# EAGLE schematic mote (EAGLE 8.4.0)
AUTHOR: NEAL JACKSON; REV: A; TITLE: MOTE

## Sheet 1 of 5
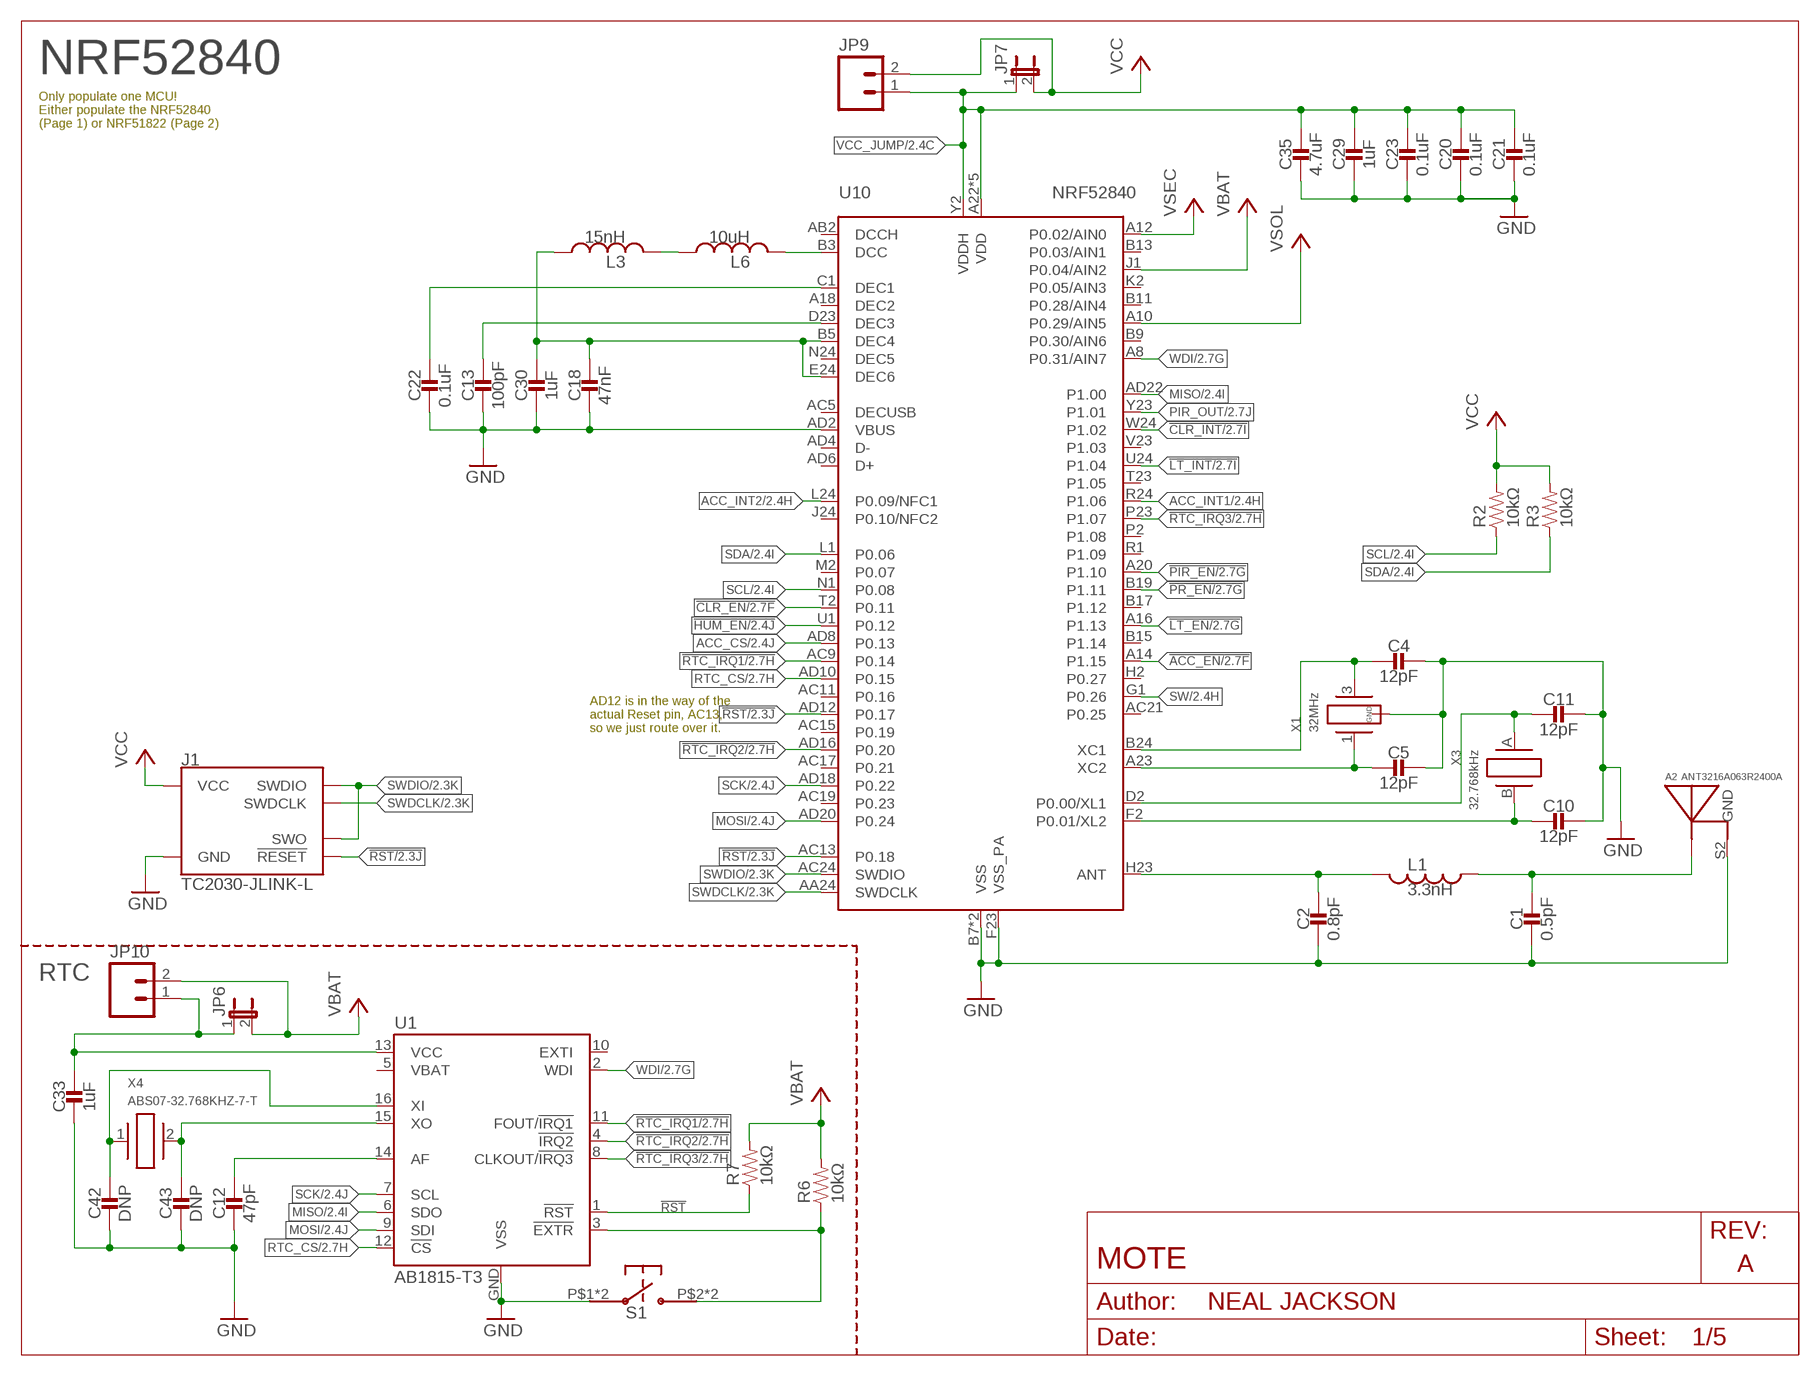
[diagram p0: schematic, sheet 1]

### Parts
A2  ANT3216A063R2400A  [ANT3216A063R2400A]
C1  0.5pF  CAPACITOR0402_CAP  [0402_CAP]
C2  0.8pF  CAPACITOR0402_CAP  [0402_CAP]
C4  12pF  CAPACITOR0402_CAP  [0402_CAP]
C5  12pF  CAPACITOR0402_CAP  [0402_CAP]
C10  12pF  CAPACITOR0402_CAP  [0402_CAP]
C11  12pF  CAPACITOR0402_CAP  [0402_CAP]
C12  47pF  CAPACITOR0402_CAP  [0402_CAP]
C13  100pF  CAPACITOR0402_CAP  [0402_CAP]
C18  47nF  CAPACITOR0402_CAP  [0402_CAP]
C20  0.1uF  CAPACITOR0402_CAP  [0402_CAP]
C21  0.1uF  CAPACITOR0402_CAP  [0402_CAP]
C22  0.1uF  CAPACITOR0402_CAP  [0402_CAP]
C23  0.1uF  CAPACITOR0402_CAP  [0402_CAP]
C29  1uF  CAPACITOR0402_CAP  [0402_CAP]
C30  1uF  CAPACITOR0402_CAP  [0402_CAP]
C33  1uF  CAPACITOR0402_CAP  [0402_CAP]
C35  4.7uF  CAPACITOR0402_CAP  [0402_CAP]
C42  DNP  CAPACITOR0402_CAP  [0402_CAP]
C43  DNP  CAPACITOR0402_CAP  [0402_CAP]
J1  TC2030-JLINK-L  [TC2030-IDC]
JP6  JUMPER-2SMD-NC  [SJ_2S]
JP7  JUMPER-2SMD-NC  [SJ_2S]
JP9  M02PTH  [1X02]
JP10  M02PTH  [1X02]
L1  3.3nH  INDUCTOR0402  [0402_CAP]
L3  15nH  INDUCTOR0402  [0402_CAP]
L6  10uH  INDUCTOR0603  [0603_CAP]
R2  10kΩ  RESISTOR0402_RES  [0402_RES]
R3  10kΩ  RESISTOR0402_RES  [0402_RES]
R6  10kΩ  RESISTOR0402_RES  [0402_RES]
R7  10kΩ  RESISTOR0402_RES  [0402_RES]
S1  EVQP2  [EVQP2]
U1  AB1815-T3  [QFN-16-3MM]
U10  NRF52840  [AQFN73]
X1  32MHz  7V-32.000MAHV-T  [TXC-7V]
X3  32.768kHz  ABS05-32.768KHZ-9-T  [ABS05]
X4  ABS07-32.768KHZ-7-T  [2-SMD]

### Nets
!ACC_EN: U10.A14(P1.15) ; also sheet 2,5
!CLR_EN: U10.T2(P0.11) ; also sheet 2,4,5
!CLR_INT: U10.W24(P1.02) ; also sheet 2,4,5
!HUM_EN: U10.U1(P0.12) ; also sheet 2,4,5
!LT_EN: U10.A16(P1.13) ; also sheet 2,4,5
!LT_INT: U10.U24(P1.04) ; also sheet 2,4,5
!PIR_EN: U10.A20(P1.10) ; also sheet 2,4,5
!PR_EN: U10.B19(P1.11) ; also sheet 2,4,5
!RST: J1.3(!RESET) R7.1 U1.1(!RST) U10.AC13(P0.18) U10.AD12(P0.17) ; also sheet 2,5
!RTC_EXTR: R6.1 S1.P$2 S1.P$4 U1.3(!EXTR)
!RTC_IRQ1: U1.11(FOUT/!IRQ1) U10.AC9(P0.14) ; also sheet 2,5
!RTC_IRQ2: U1.4(!IRQ2) U10.AD16(P0.20) ; also sheet 2,5
!RTC_IRQ3: U1.8(CLKOUT/!IRQ3) U10.P23(P1.07) ; also sheet 2,5
ACC_CS: U10.AD8(P0.13) ; also sheet 2,4,5
ACC_INT1: U10.R24(P1.06) ; also sheet 2,4,5
ACC_INT2: U10.L24(P0.09/NFC1) ; also sheet 2,4,5
GND: A2.S2(GND) C1.2 C2.2 C4.1 C5.1 C10.1 C11.1 C12.2 C13.2 C18.2 C20.2 C21.2 C22.2 C23.2 C29.2 C30.2 C33.2 C35.2 C42.2 C43.2 J1.5(GND) S1.P$1 S1.P$3 U1.GND(VSS) U10.AD2(VBUS) U10.B7(VSS) U10.F23(VSS_PA) U10.GND(VSS) X1.2(GND) X1.4(GND) ; also sheet 2,3,4,5
MISO: U1.6(SDO) U10.AD22(P1.00) ; also sheet 2,4,5
MOSI: U1.9(SDI) U10.AD20(P0.24) ; also sheet 2,4,5
N$2: C22.1 U10.C1(DEC1)
N$3: C18.1 C30.1 L3.1 U10.B5(DEC4) U10.E24(DEC6)
N$4: C13.1 U10.D23(DEC3)
N$5: C2.1 L1.2 U10.H23(ANT)
N$6: A2.S1(ANTENNA) C1.1 L1.1
N$8: C4.2 U10.B24(XC1) X1.3
N$9: C5.2 U10.A23(XC2) X1.1
N$25: C12.1 U1.14(AF)
N$26: C42.1 U1.16(XI) X4.1
N$27: C43.1 U1.15(XO) X4.2
N$42: C33.1 JP6.1 JP10.1 U1.13(VCC)
N$44: L6.2 U10.B3(DCC)
N$49: L3.2 L6.1
PIR_OUT: U10.Y23(P1.01) ; also sheet 2,4,5
RTC_CS: U1.12(!CS) U10.AD10(P0.15) ; also sheet 2,5
SCK: U1.7(SCL) U10.AD18(P0.22) ; also sheet 2,4,5
SCL: R2.1 U10.N1(P0.08) ; also sheet 2,4,5
SDA: R3.1 U10.L1(P0.06) ; also sheet 2,4,5
SW: U10.G1(P0.26) ; also sheet 2,3,5
SWDCLK: J1.4(SWDCLK) U10.AA24(SWDCLK) ; also sheet 2
SWDIO: J1.2(SWDIO) J1.6(SWO) U10.AC24(SWDIO) ; also sheet 2
VBAT: JP6.2 JP10.2 R6.2 R7.2 U10.J1(P0.04/AIN2) ; also sheet 2,3,5
VCC: J1.1(VCC) JP7.2 JP9.2 R2.2 R3.2 ; also sheet 3,4
VCC_JUMP: C20.1 C21.1 C23.1 C29.1 C35.1 JP7.1 JP9.1 U10.A22(VDD) U10.AD14(VDD) U10.AD23(VDD) U10.B1(VDD) U10.W1(VDD) U10.Y2(VDDH) ; also sheet 2
VSEC: U10.A12(P0.02/AIN0) ; also sheet 2,3,5
VSOL: U10.A10(P0.29/AIN5) ; also sheet 2,3,5
WDI: U1.2(WDI) U10.A8(P0.31/AIN7) ; also sheet 2,5
XL1: C11.2 U10.D2(P0.00/XL1) X3.A
XL2: C10.2 U10.F2(P0.01/XL2) X3.B
Unconnected: U1.5(VBAT) U1.10(EXTI) U10.A18(DEC2) U10.AB2(DCCH) U10.AC5(DECUSB) U10.AC11(P0.16) U10.AC15(P0.19) U10.AC17(P0.21) U10.AC19(P0.23) U10.AC21(P0.25) U10.AD4(D-) U10.AD6(D+) U10.B9(P0.30/AIN6) U10.B11(P0.28/AIN4) U10.B13(P0.03/AIN1) U10.B15(P1.14) U10.B17(P1.12) U10.H2(P0.27) U10.J24(P0.10/NFC2) U10.K2(P0.05/AIN3) U10.M2(P0.07) U10.N24(DEC5) U10.P2(P1.08) U10.R1(P1.09) U10.T23(P1.05) U10.V23(P1.03)

### Notes on the sheet
- NRF52840
- Only populate one MCU!
  Either populate the NRF52840
  (Page 1) or NRF51822 (Page 2)
- AD12 is in the way of the
  actual Reset pin, AC13,
  so we just route over it.
- RTC

## Sheet 2 of 5
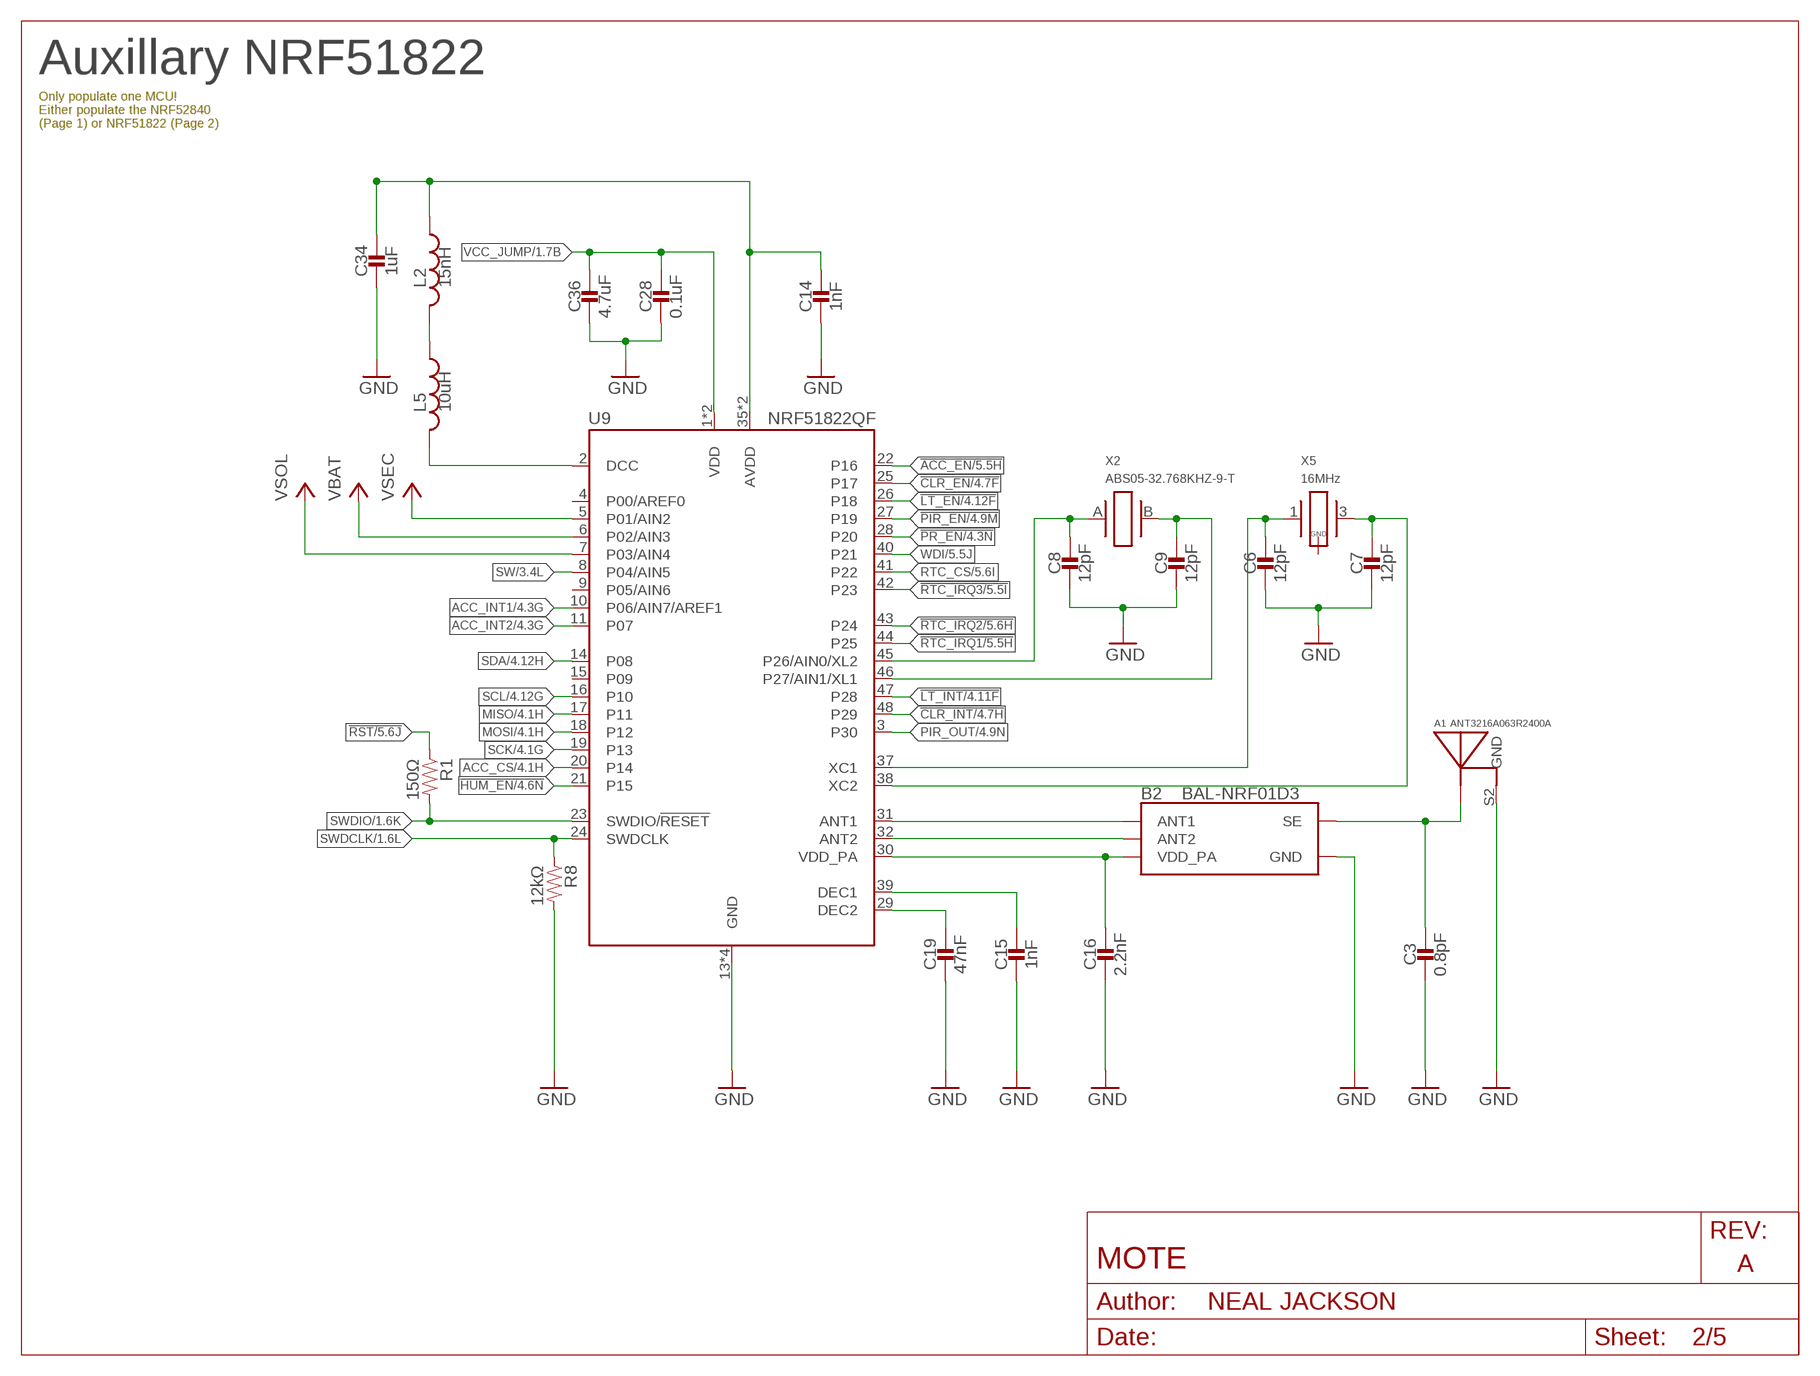
[diagram p1: schematic, sheet 2]

### Parts
A1  ANT3216A063R2400A  [ANT3216A063R2400A]
B2  BAL-NRF01D3  [BAL-NRF01D3]
C3  0.8pF  CAPACITOR0402_CAP  [0402_CAP]
C6  12pF  CAPACITOR0402_CAP  [0402_CAP]
C7  12pF  CAPACITOR0402_CAP  [0402_CAP]
C8  12pF  CAPACITOR0402_CAP  [0402_CAP]
C9  12pF  CAPACITOR0402_CAP  [0402_CAP]
C14  1nF  CAPACITOR0402_CAP  [0402_CAP]
C15  1nF  CAPACITOR0402_CAP  [0402_CAP]
C16  2.2nF  CAPACITOR0402_CAP  [0402_CAP]
C19  47nF  CAPACITOR0402_CAP  [0402_CAP]
C28  0.1uF  CAPACITOR0402_CAP  [0402_CAP]
C34  1uF  CAPACITOR0402_CAP  [0402_CAP]
C36  4.7uF  CAPACITOR0402_CAP  [0402_CAP]
L2  15nH  INDUCTOR0402  [0402_CAP]
L5  10uH  INDUCTOR0603  [0603_CAP]
R1  150Ω  RESISTOR0402_RES  [0402_RES]
R8  12kΩ  RESISTOR0402_RES  [0402_RES]
U9  NRF51822QF  [QFN-48-6MM]
X2  ABS05-32.768KHZ-9-T  [ABS05]
X5  16MHz  TXC-8Y  [TXC-8Y]

### Nets
!ACC_EN: U9.22(P16) ; also sheet 1,5
!CLR_EN: U9.25(P17) ; also sheet 1,4,5
!CLR_INT: U9.48(P29) ; also sheet 1,4,5
!HUM_EN: U9.21(P15) ; also sheet 1,4,5
!LT_EN: U9.26(P18) ; also sheet 1,4,5
!LT_INT: U9.47(P28) ; also sheet 1,4,5
!PIR_EN: U9.27(P19) ; also sheet 1,4,5
!PR_EN: U9.28(P20) ; also sheet 1,4,5
!RST: R1.1 ; also sheet 1,5
!RTC_IRQ1: U9.44(P25) ; also sheet 1,5
!RTC_IRQ2: U9.43(P24) ; also sheet 1,5
!RTC_IRQ3: U9.42(P23) ; also sheet 1,5
ACC_CS: U9.20(P14) ; also sheet 1,4,5
ACC_INT1: U9.10(P06/AIN7/AREF1) ; also sheet 1,4,5
ACC_INT2: U9.11(P07) ; also sheet 1,4,5
AVDD1: C14.1 C34.1 L2.1 U9.35(AVDD) U9.36(AVDD)
DCC1: L5.2 U9.2(DCC)
GND: A1.S2(GND) B2.GND C3.2 C6.2 C7.2 C8.2 C9.2 C14.2 C15.2 C16.2 C19.2 C28.2 C34.2 C36.2 R8.2 U9.13(GND) U9.33(GND) U9.34(GND) U9.GND ; also sheet 1,3,4,5
MISO: U9.17(P11) ; also sheet 1,4,5
MOSI: U9.18(P12) ; also sheet 1,4,5
N$60: B2.ANT1 U9.31(ANT1)
N$61: B2.ANT2 U9.32(ANT2)
N$62: A1.S1(ANTENNA) B2.SE C3.1
N$63: L2.2 L5.1
N$64: C6.1 U9.37(XC1) X5.1
N$65: C7.1 U9.38(XC2) X5.3
N$66: C15.1 U9.39(DEC1)
N$67: C19.1 U9.29(DEC2)
NRF_A2: C9.1 U9.46(P27/AIN1/XL1) X2.B
NRF_A3: C8.1 U9.45(P26/AIN0/XL2) X2.A
PIR_OUT: U9.3(P30) ; also sheet 1,4,5
RTC_CS: U9.41(P22) ; also sheet 1,5
SCK: U9.19(P13) ; also sheet 1,4,5
SCL: U9.16(P10) ; also sheet 1,4,5
SDA: U9.14(P08) ; also sheet 1,4,5
SW: U9.8(P04/AIN5) ; also sheet 1,3,5
SWDCLK: R8.1 U9.24(SWDCLK) ; also sheet 1
SWDIO: R1.2 U9.23(SWDIO/!RESET) ; also sheet 1
VBAT: U9.6(P02/AIN3) ; also sheet 1,3,5
VCC_JUMP: C28.1 C36.1 U9.1(VDD) U9.12(VDD) ; also sheet 1
VDD_PA1: B2.VCC(VDD_PA) C16.1 U9.30(VDD_PA)
VSEC: U9.5(P01/AIN2) ; also sheet 1,3,5
VSOL: U9.7(P03/AIN4) ; also sheet 1,3,5
WDI: U9.40(P21) ; also sheet 1,5
Unconnected: U9.4(P00/AREF0) U9.9(P05/AIN6) U9.15(P09) X5.2(GND) X5.4(GND)

### Notes on the sheet
- Auxillary NRF51822
- Only populate one MCU!
  Either populate the NRF52840
  (Page 1) or NRF51822 (Page 2)

## Sheet 3 of 5
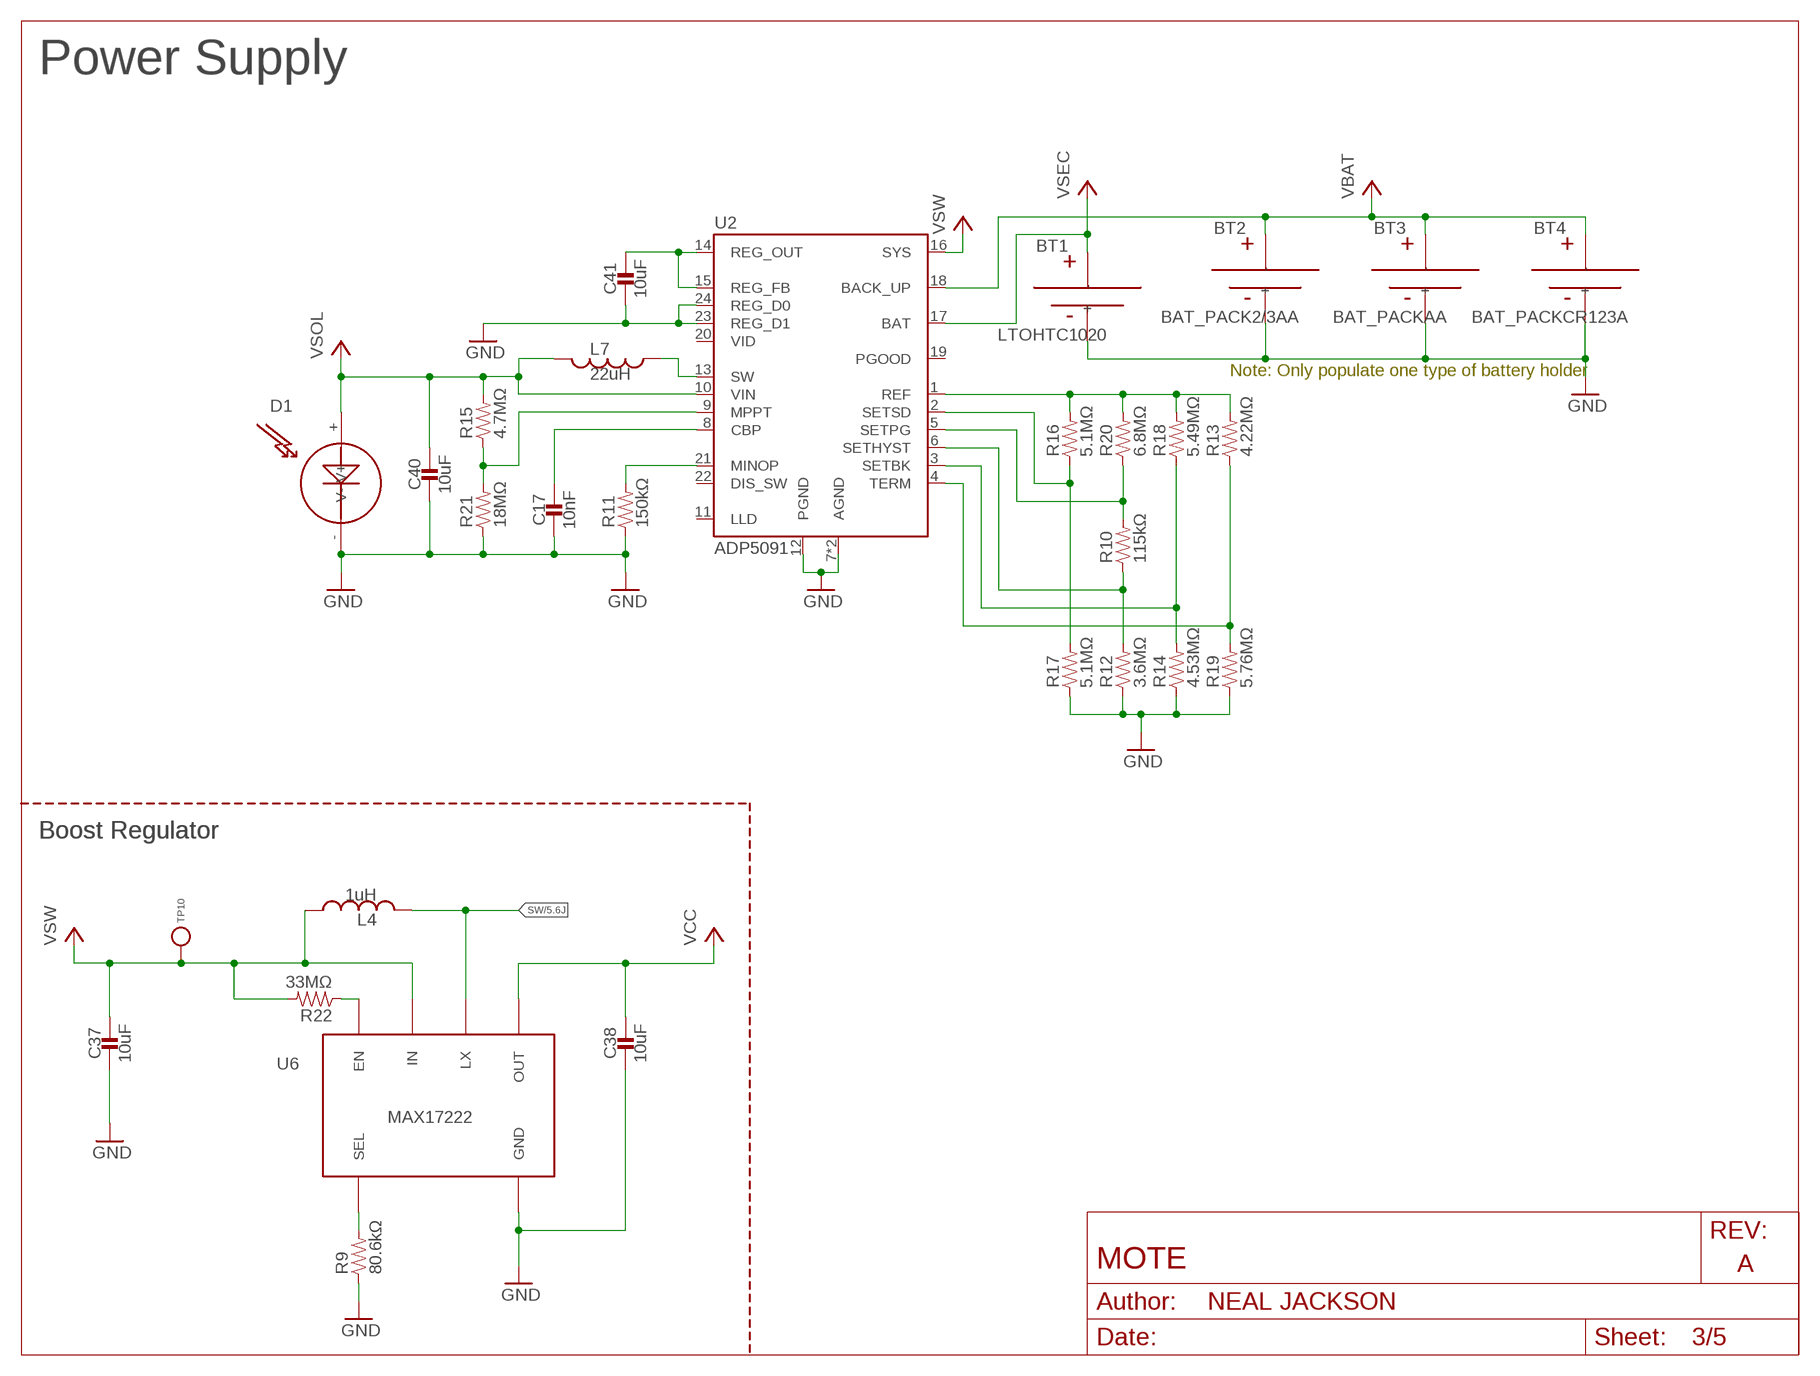
[diagram p2: schematic, sheet 3]

### Parts
BT1  LTOHTC1020  [1020]
BT2  BAT_PACK2/3AA  [6S-2-3A]
BT3  BAT_PACKAA  [BHAA-3]
BT4  BAT_PACKCR123A  [BH123A]
C17  10nF  CAPACITOR0603_CAP  [0603_CAP]
C37  10uF  CAPACITOR0603_CAP  [0603_CAP]
C38  10uF  CAPACITOR0603_CAP  [0603_CAP]
C40  10uF  CAPACITOR0603_CAP  [0603_CAP]
C41  10uF  CAPACITOR0603_CAP  [0603_CAP]
D1  SOLARCELL  [SOLAR_HOLES]
L4  1uH  INDUCTORIHL2525CZ  [IHL-2525CZ]
L7  22uH  INDUCTOR74437324220  [74437324220]
R9  80.6kΩ  RESISTOR0603_RES  [0603-RES]
R10  115kΩ  RESISTOR0402_RES  [0402_RES]
R11  150kΩ  RESISTOR0402_RES  [0402_RES]
R12  3.6MΩ  RESISTOR0402_RES  [0402_RES]
R13  4.22MΩ  RESISTOR0402_RES  [0402_RES]
R14  4.53MΩ  RESISTOR0402_RES  [0402_RES]
R15  4.7MΩ  RESISTOR0402_RES  [0402_RES]
R16  5.1MΩ  RESISTOR0402_RES  [0402_RES]
R17  5.1MΩ  RESISTOR0402_RES  [0402_RES]
R18  5.49MΩ  RESISTOR0603_RES  [0603-RES]
R19  5.76MΩ  RESISTOR0805_RES  [0805_RES]
R20  6.8MΩ  RESISTOR0402_RES  [0402_RES]
R21  18MΩ  RESISTOR0603_RES  [0603-RES]
R22  33MΩ  RESISTOR0603_RES  [0603-RES]
TP10  TEST_POINT_0.040IN  [TESTPOINT_0.040IN]
U2  ADP5091  [QFN-24-4MM]
U6  MAX17222  [UDFN-6-MAXIM]

### Nets
GND: BT1.- BT2.- BT3.- BT4.- C17.2 C37.2 C38.2 C40.2 C41.2 D1.-(V-) R9.1 R11.1 R12.1 R14.1 R17.1 R19.1 R21.1 U2.7(AGND) U2.12(PGND) U2.23(REG_D1) U2.24(REG_D0) U2.GND_PAD(AGND) U6.3(GND) ; also sheet 1,2,4,5
N$1: R16.1 R17.2 U2.2(SETSD)
N$10: R13.2 R16.2 R18.2 R20.2 U2.1(REF)
N$11: R10.2 R20.1 U2.5(SETPG)
N$12: R9.2 U6.4(SEL)
N$13: R10.1 R12.2 U2.6(SETHYST)
N$14: R22.1 U6.6(EN)
N$16: R14.2 R18.1 U2.3(SETBK)
N$17: R13.1 R19.2 U2.4(TERM)
N$18: R11.2 U2.21(MINOP)
N$30: C17.1 U2.8(CBP)
N$32: R15.1 R21.2 U2.9(MPPT)
N$45: L7.P$1 U2.13(SW)
N$47: C41.1 U2.14(REG_OUT) U2.15(REG_FB)
SW: L4.P$2 U6.2(LX) ; also sheet 1,2,5
VBAT: BT2.+ BT3.+ BT4.+ U2.18(BACK_UP) ; also sheet 1,2,5
VCC: C38.1 U6.1(OUT) ; also sheet 1,4
VSEC: BT1.+ U2.17(BAT) ; also sheet 1,2,5
VSOL: C40.1 D1.+(V+) L7.P$2 R15.2 U2.10(VIN) ; also sheet 1,2,5
VSW: C37.1 L4.P$1 R22.2 TP10.TESTPOINT U2.16(SYS) U6.5(IN)
Unconnected: U2.11(LLD) U2.19(PGOOD) U2.20(VID) U2.22(DIS_SW)

### Notes on the sheet
- Power Supply
- Note: Only populate one type of battery holder
- Boost Regulator | Boost Regulator

## Sheet 4 of 5
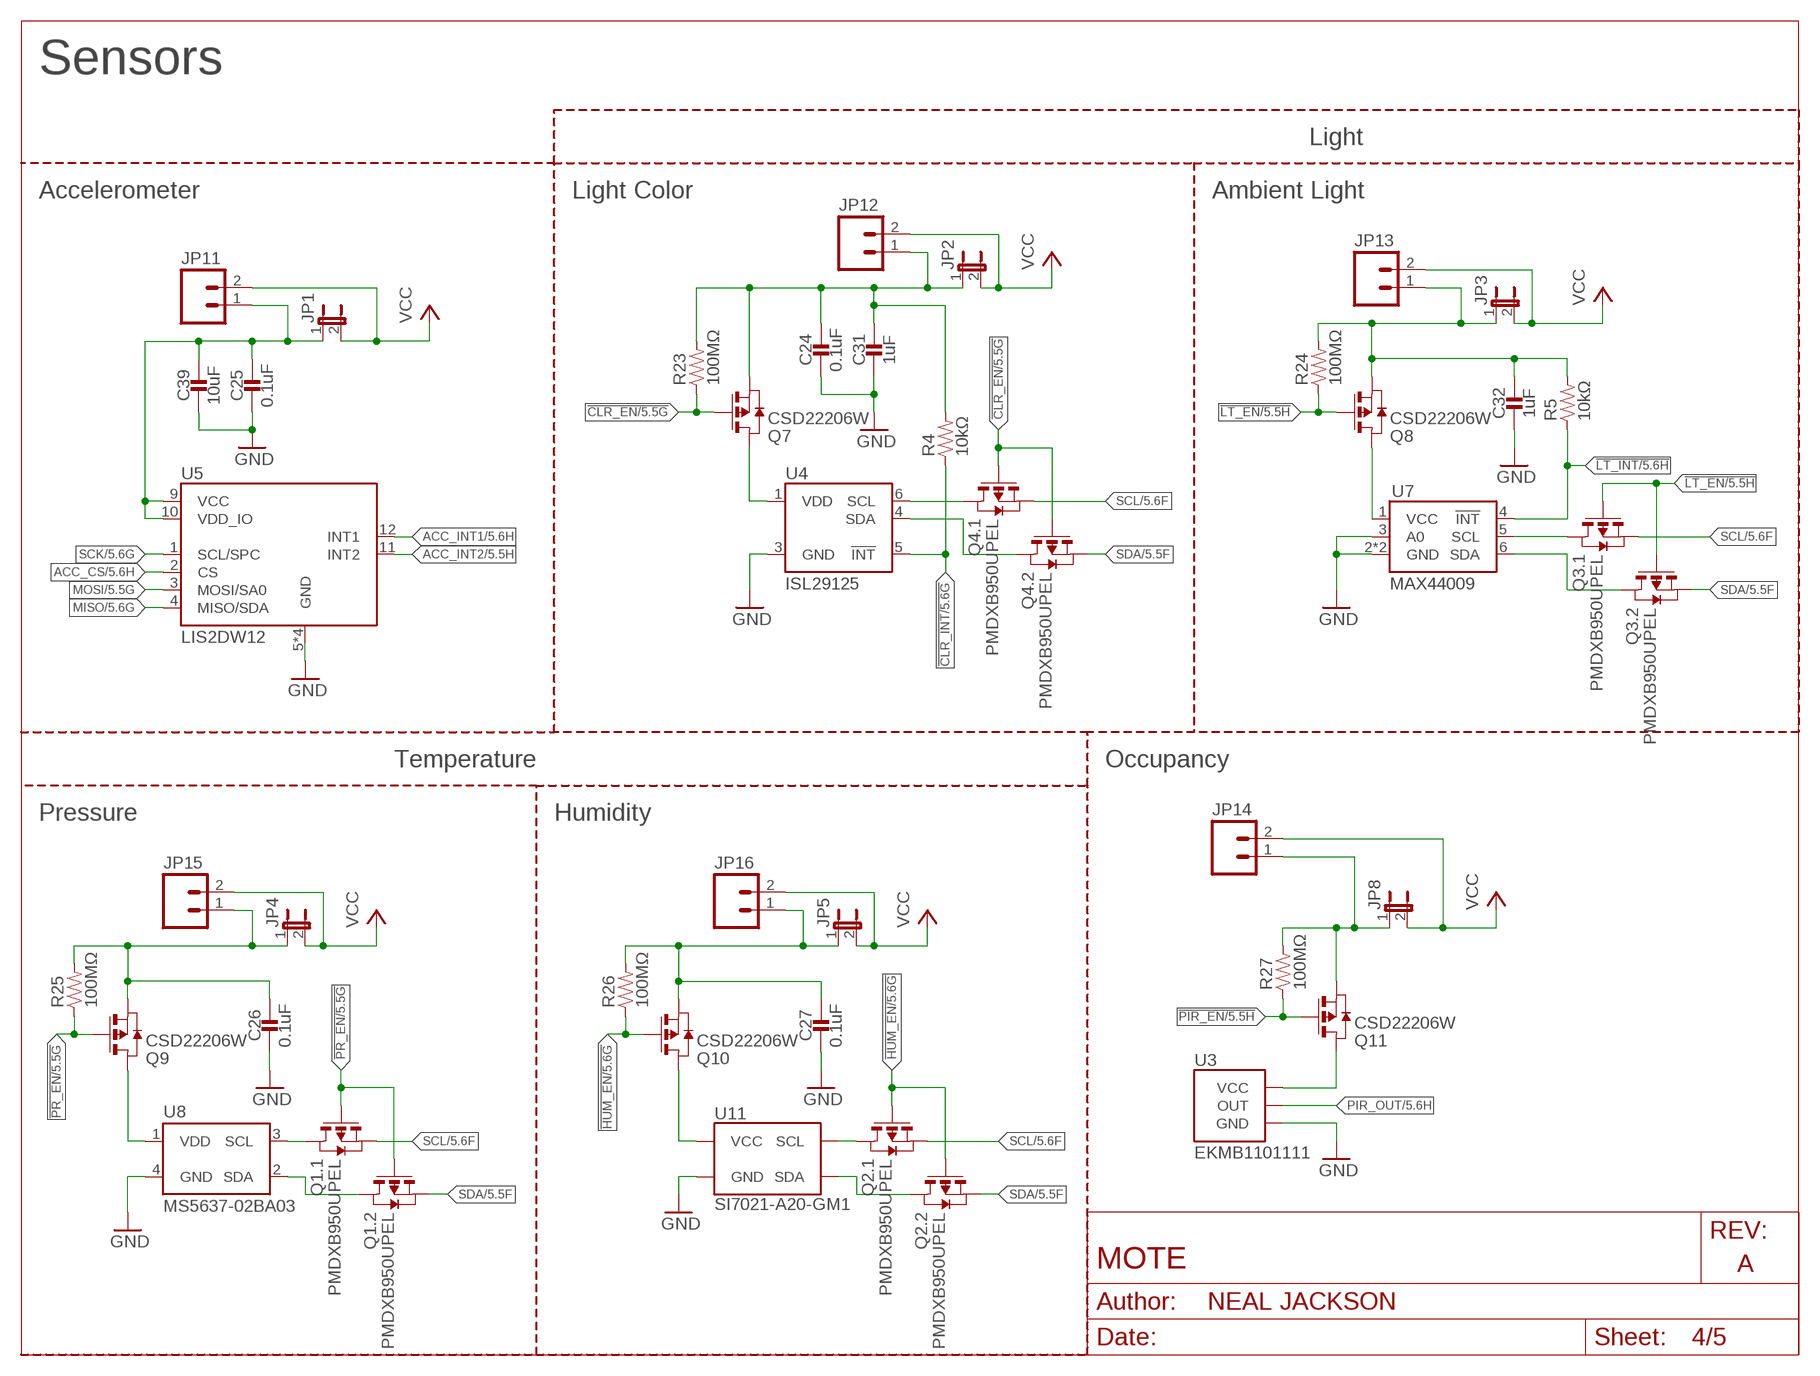
[diagram p3: schematic, sheet 4]

### Parts
C24  0.1uF  CAPACITOR0402_CAP  [0402_CAP]
C25  0.1uF  CAPACITOR0402_CAP  [0402_CAP]
C26  0.1uF  CAPACITOR0402_CAP  [0402_CAP]
C27  0.1uF  CAPACITOR0402_CAP  [0402_CAP]
C31  1uF  CAPACITOR0402_CAP  [0402_CAP]
C32  1uF  CAPACITOR0402_CAP  [0402_CAP]
C39  10uF  CAPACITOR0603_CAP  [0603_CAP]
JP1  JUMPER-2SMD-NC  [SJ_2S]
JP2  JUMPER-2SMD-NC  [SJ_2S]
JP3  JUMPER-2SMD-NC  [SJ_2S]
JP4  JUMPER-2SMD-NC  [SJ_2S]
JP5  JUMPER-2SMD-NC  [SJ_2S]
JP8  JUMPER-2SMD-NC  [SJ_2S]
JP11  M02PTH  [1X02]
JP12  M02PTH  [1X02]
JP13  M02PTH  [1X02]
JP14  M02PTH  [1X02]
JP15  M02PTH  [1X02]
JP16  M02PTH  [1X02]
Q1  PMDXB950UPEL  [XDFN-6]
Q2  PMDXB950UPEL  [XDFN-6]
Q3  PMDXB950UPEL  [XDFN-6]
Q4  PMDXB950UPEL  [XDFN-6]
Q7  CSD22206W  [DSBGA]
Q8  CSD22206W  [DSBGA]
Q9  CSD22206W  [DSBGA]
Q10  CSD22206W  [DSBGA]
Q11  CSD22206W  [DSBGA]
R4  10kΩ  RESISTOR0402_RES  [0402_RES]
R5  10kΩ  RESISTOR0402_RES  [0402_RES]
R23  100MΩ  RESISTOR0402_RES  [0402_RES]
R24  100MΩ  RESISTOR0402_RES  [0402_RES]
R25  100MΩ  RESISTOR0402_RES  [0402_RES]
R26  100MΩ  RESISTOR0402_RES  [0402_RES]
R27  100MΩ  RESISTOR0402_RES  [0402_RES]
U3  EKMB1101111  [AMN2]
U4  ISL29125  [ODFN-6-1.5MMX1.6MM]
U5  LIS2DW12  [LGA-12]
U7  MAX44009  [UDFN-6-EXPOSED]
U8  MS5637-02BA03  [4-SMD]
U11  SI7021-A20-GM1  [DFN-6/3MM]

### Nets
!CLR_EN: Q4.2(.1:G) Q4.5(.2:G) Q7.A1(G) R23.1 ; also sheet 1,2,5
!CLR_INT: R4.1 U4.5(!INT) ; also sheet 1,2,5
!HUM_EN: Q2.2(.1:G) Q2.5(.2:G) Q10.A1(G) R26.1 ; also sheet 1,2,5
!LT_EN: Q3.2(.1:G) Q3.5(.2:G) Q8.A1(G) R24.1 ; also sheet 1,2,5
!LT_INT: R5.1 U7.4(!INT) ; also sheet 1,2,5
!PIR_EN: Q11.A1(G) R27.1 ; also sheet 1,2,5
!PR_EN: Q1.2(.1:G) Q1.5(.2:G) Q9.A1(G) R25.1 ; also sheet 1,2,5
ACC_CS: U5.2(CS) ; also sheet 1,2,5
ACC_INT1: U5.12(INT1) ; also sheet 1,2,5
ACC_INT2: U5.11(INT2) ; also sheet 1,2,5
GND: C24.2 C25.2 C26.2 C27.2 C31.2 C32.2 C39.2 U3.GND U4.3(GND) U5.5(GND) U5.6(GND) U5.7(GND) U5.8(GND) U7.2(GND) U7.3(A0) U7.EP(GND) U8.4(GND) U11.2(GND) ; also sheet 1,2,3,5
MISO: U5.4(MISO/SDA) ; also sheet 1,2,5
MOSI: U5.3(MOSI/SA0) ; also sheet 1,2,5
N$15: C25.1 C39.1 JP1.1 JP11.1 U5.9(VCC) U5.10(VDD_IO)
N$19: C26.1 JP4.1 JP15.1 Q9.A2(S) Q9.A3(S) Q9.B1(S) Q9.B2(S) Q9.B3(S) R25.2
N$20: Q8.C1(D) Q8.C2(D) Q8.C3(D) U7.1(VCC)
N$21: Q9.C1(D) Q9.C2(D) Q9.C3(D) U8.1(VDD)
N$22: Q10.C1(D) Q10.C2(D) Q10.C3(D) U11.5(VCC)
N$23: Q11.C1(D) Q11.C2(D) Q11.C3(D) U3.VCC
N$24: JP8.1 JP14.1 Q11.A2(S) Q11.A3(S) Q11.B1(S) Q11.B2(S) Q11.B3(S) R27.2
N$31: Q7.C1(D) Q7.C2(D) Q7.C3(D) U4.1(VDD)
N$33: C24.1 C31.1 JP2.1 JP12.1 Q7.A2(S) Q7.A3(S) Q7.B1(S) Q7.B2(S) Q7.B3(S) R4.2 R23.2
N$34: Q1.6(.1:D) U8.3(SCL)
N$36: C27.1 JP5.1 JP16.1 Q10.A2(S) Q10.A3(S) Q10.B1(S) Q10.B2(S) Q10.B3(S) R26.2
N$37: C32.1 JP3.1 JP13.1 Q8.A2(S) Q8.A3(S) Q8.B1(S) Q8.B2(S) Q8.B3(S) R5.2 R24.2
N$41: Q1.3(.2:D) U8.2(SDA)
N$48: Q2.3(.2:D) U11.1(SDA)
N$50: Q2.6(.1:D) U11.6(SCL)
N$51: Q3.3(.2:D) U7.6(SDA)
N$52: Q3.6(.1:D) U7.5(SCL)
N$54: Q4.3(.2:D) U4.4(SDA)
N$55: Q4.6(.1:D) U4.6(SCL)
PIR_OUT: U3.OUT ; also sheet 1,2,5
SCK: U5.1(SCL/SPC) ; also sheet 1,2,5
SCL: Q1.1(.1:S) Q2.1(.1:S) Q3.1(.1:S) Q4.1(.1:S) ; also sheet 1,2,5
SDA: Q1.4(.2:S) Q2.4(.2:S) Q3.4(.2:S) Q4.4(.2:S) ; also sheet 1,2,5
VCC: JP1.2 JP2.2 JP3.2 JP4.2 JP5.2 JP8.2 JP11.2 JP12.2 JP13.2 JP14.2 JP15.2 JP16.2 ; also sheet 1,3

### Notes on the sheet
- Sensors
- Light
- Accelerometer | Light Color | Ambient Light
- Temperature | Occupancy
- Pressure | Humidity

## Sheet 5 of 5
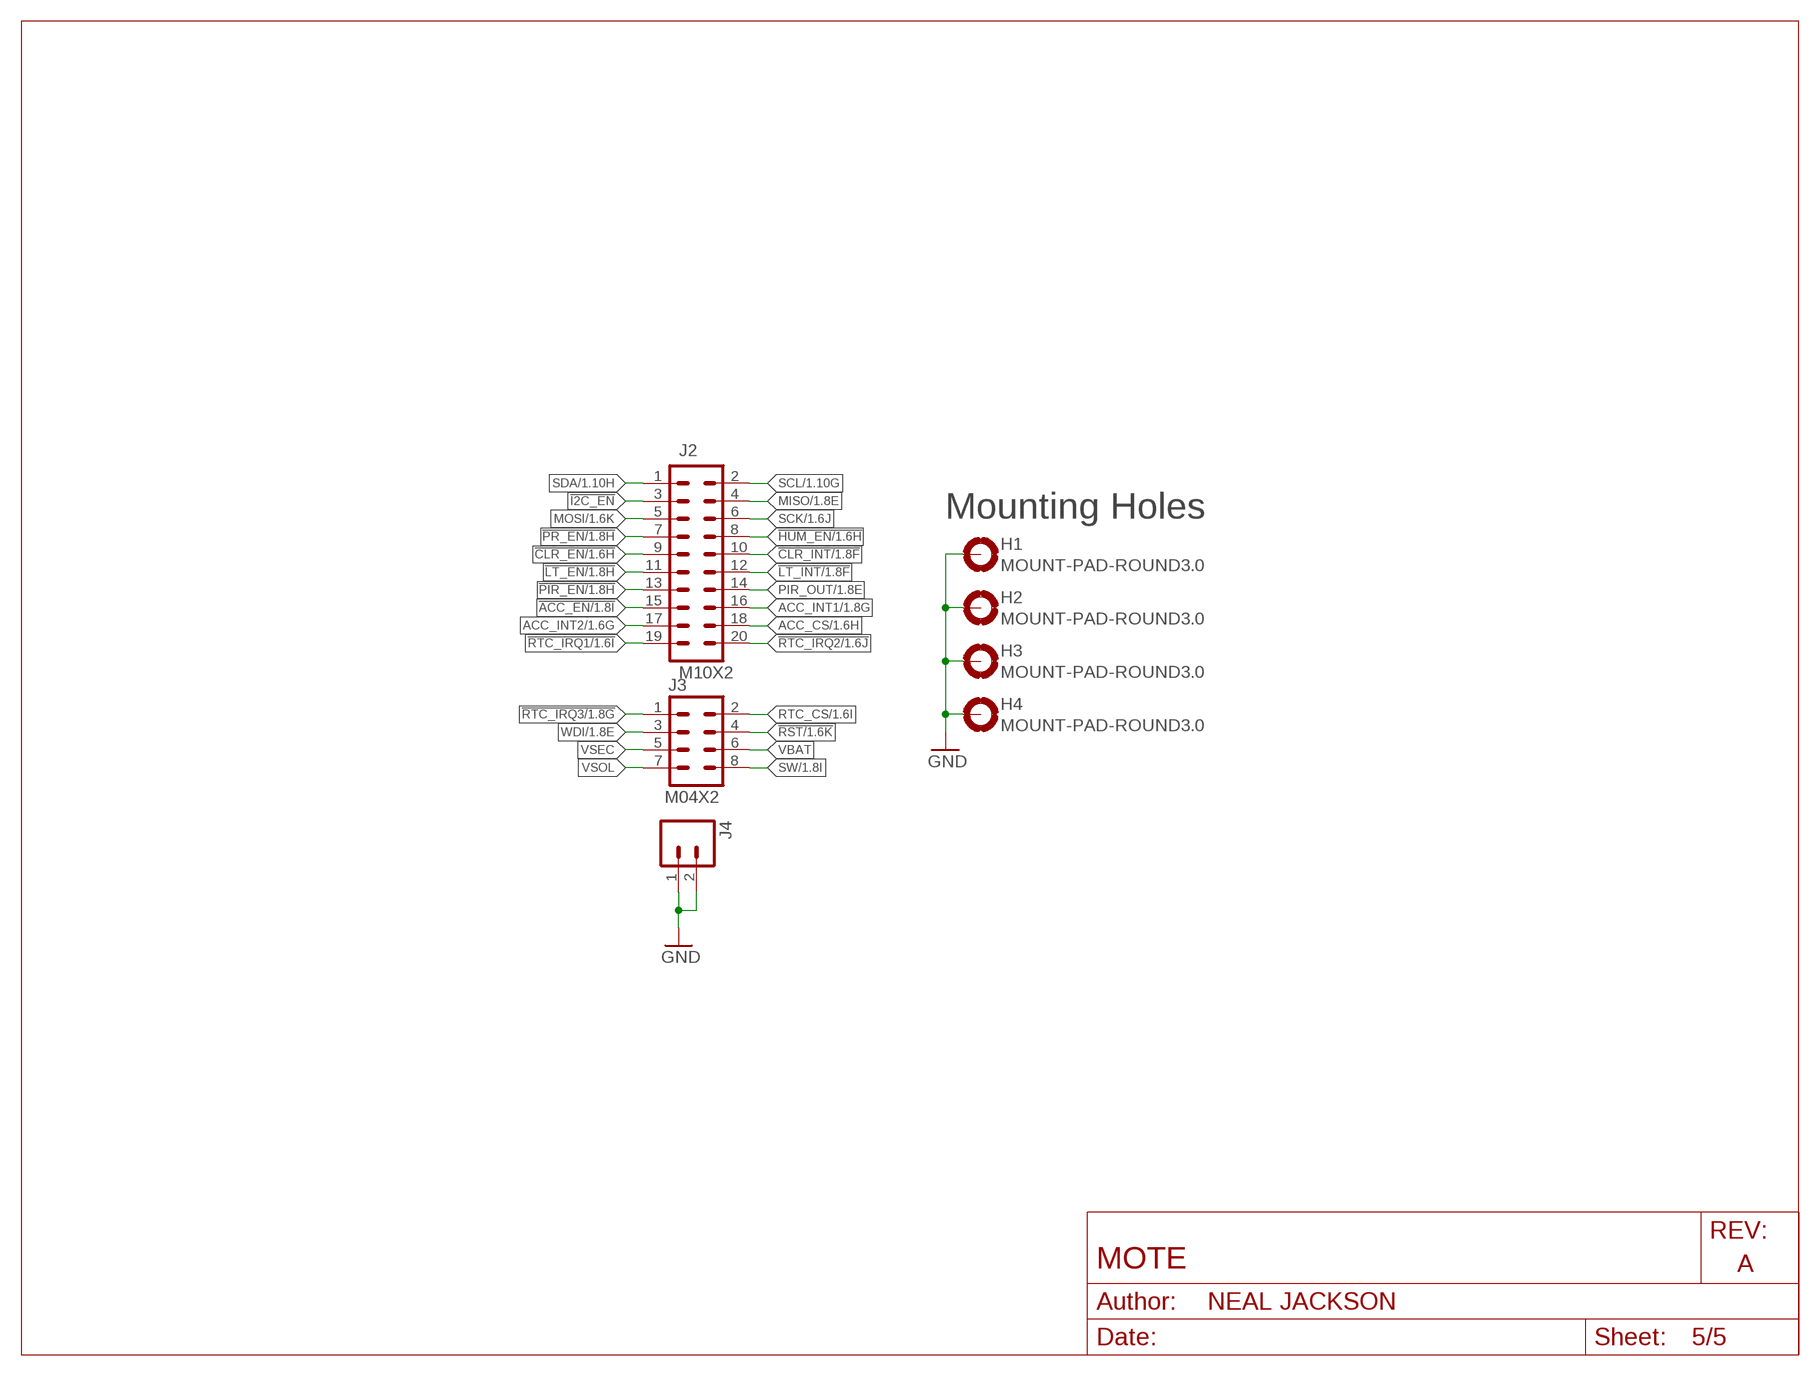
[diagram p4: schematic, sheet 5]

### Parts
H1  MOUNT-PAD-ROUND3.0  [3,0-PAD]
H2  MOUNT-PAD-ROUND3.0  [3,0-PAD]
H3  MOUNT-PAD-ROUND3.0  [3,0-PAD]
H4  MOUNT-PAD-ROUND3.0  [3,0-PAD]
J2  M10X2  [2X10]
J3  M04X2  [2X4]
J4  M02PTH  [1X02]

### Nets
!ACC_EN: J2.15 ; also sheet 1,2
!CLR_EN: J2.9 ; also sheet 1,2,4
!CLR_INT: J2.10 ; also sheet 1,2,4
!HUM_EN: J2.8 ; also sheet 1,2,4
!I2C_EN: J2.3
!LT_EN: J2.11 ; also sheet 1,2,4
!LT_INT: J2.12 ; also sheet 1,2,4
!PIR_EN: J2.13 ; also sheet 1,2,4
!PR_EN: J2.7 ; also sheet 1,2,4
!RST: J3.4 ; also sheet 1,2
!RTC_IRQ1: J2.19 ; also sheet 1,2
!RTC_IRQ2: J2.20 ; also sheet 1,2
!RTC_IRQ3: J3.1 ; also sheet 1,2
ACC_CS: J2.18 ; also sheet 1,2,4
ACC_INT1: J2.16 ; also sheet 1,2,4
ACC_INT2: J2.17 ; also sheet 1,2,4
GND: H1.B3,0(MOUNT) H2.B3,0(MOUNT) H3.B3,0(MOUNT) H4.B3,0(MOUNT) J4.1 J4.2 ; also sheet 1,2,3,4
MISO: J2.4 ; also sheet 1,2,4
MOSI: J2.5 ; also sheet 1,2,4
PIR_OUT: J2.14 ; also sheet 1,2,4
RTC_CS: J3.2 ; also sheet 1,2
SCK: J2.6 ; also sheet 1,2,4
SCL: J2.2 ; also sheet 1,2,4
SDA: J2.1 ; also sheet 1,2,4
SW: J3.8 ; also sheet 1,2,3
VBAT: J3.6 ; also sheet 1,2,3
VSEC: J3.5 ; also sheet 1,2,3
VSOL: J3.7 ; also sheet 1,2,3
WDI: J3.3 ; also sheet 1,2

### Notes on the sheet
- Mounting Holes

## Library data of the parts
A1 A2 = chips:ANT3216A063R2400A: Yageo 2.4GHz WiFi/Bluetooth/Zigbee/ISM Chip Antenna; DIGIKEY: 311-1542-1-ND; MANUFACTURER: YAGEO; MPN: ANT3216A063R2400A
B2 = chips:BAL-NRF01D3: 50 ohm nominal input / conjugate match balun to nRF51422-QFAA, nRF24LE1, nRF51822-QFAA/AB, with integrated harmonic filter; DIGIKEY: 497-13637-1-ND; MANUFACTURER: STMicroelectronics; MOUSER: 511-BAL-NRF01D3; MPN: BAL-NRF01D3
BT1 = batteries:LTOHTC
BT2 = batteries:BAT_PACK: collection of battery footprints; DIGIKEY: 6S-2-3A-ND; MANUFACTURER: MPD; MPN: 6S-2-3A
BT3 = batteries:BAT_PACK: collection of battery footprints; DIGIKEY: BHAA-3-ND; MANUFACTURER: MPD; MPN: BHAA-3
BT4 = batteries:BAT_PACK: collection of battery footprints; DIGIKEY: BH123A-ND; MANUFACTURER: MPD; MPN: BH123A
C1 = passives:CAPACITOR: SMD Capacitor; DIGIKEY: 490-6264-1-ND
C2 C3 = passives:CAPACITOR: SMD Capacitor; DIGIKEY: 490-6269-1-ND
C4-C11 = passives:CAPACITOR: SMD Capacitor; DIGIKEY: 490-6197-1-ND
C12 = passives:CAPACITOR: SMD Capacitor; DIGIKEY: 490-5942-1-ND
C13 = passives:CAPACITOR: SMD Capacitor; DIGIKEY: 490-5922-1-ND
C14 C15 = passives:CAPACITOR: SMD Capacitor; DIGIKEY: 490-1303-1-ND
C16 = passives:CAPACITOR: SMD Capacitor; DIGIKEY: 490-5419-1-ND
C17 = passives:CAPACITOR: SMD Capacitor; DIGIKEY: 490-4516-1-ND
C18 C19 = passives:CAPACITOR: SMD Capacitor; DIGIKEY: 445-1264-1-ND
C20-C28 = passives:CAPACITOR: SMD Capacitor; DIGIKEY: 490-6328-1-ND
C29-C34 = passives:CAPACITOR: SMD Capacitor; DIGIKEY: 490-7195-1-ND
C35 C36 = passives:CAPACITOR: SMD Capacitor; DIGIKEY: 445-5947-1-ND
C37-C41 = passives:CAPACITOR: SMD Capacitor; DIGIKEY: 490-3896-1-ND
C42 C43 = passives:CAPACITOR: SMD Capacitor
D1 = mote:SOLARCELL: Generic solar cell
H1-H4 = holes:MOUNT-PAD-ROUND: MOUNTING PAD, round
J1 = connector:TC2030-JLINK
J2 = SparkFun-Connectors:M10X2: This was SPECIALLY designed to be used with our Graphic LCD Backpack. Be sure you want to use this! It is not only staggered on each line of header holes, but IT IS ALSO offset of the center point of the top and bottom lines by 5 mil. This causes the headers to lock into place on the "standard" footprint on the LCD screen. The extra squares on the tdocu layer are there simply to reference other pins (if you were to actually populate a longer header than ten long - this is what we do with the backpacks).
J3 = SparkFun-Connectors:M04X2: .1" header, two rows of four.
J4 JP9-JP16 = SparkFun-Connectors:M02: Header 2 Standard 2-pin 0.1" header. Use with straight break away headers (SKU : PRT-00116), right angle break away headers (PRT-00553), swiss pins (PRT-00743), machine pins (PRT-00117), and female headers (PRT-00115). Molex polarized connector foot print use with SKU : PRT-08233 with associated crimp pins and housings.
JP1-JP8 = SparkFun-Passives:JUMPER-2: Jumper Basic 0.1" spaced jumper. Use with breakaway headers.
L1 = passives:INDUCTOR: A very specific inductor; DIGIKEY: 535-10426-1-ND
L2 L3 = passives:INDUCTOR: A very specific inductor; DIGIKEY: 587-1521-1-ND
L4 = passives:INDUCTOR: A very specific inductor; DIGIKEY: 541-2562-1-ND
L5 L6 = passives:INDUCTOR: A very specific inductor; DIGIKEY: 490-4025-1-ND
L7 = passives:INDUCTOR: A very specific inductor; DIGIKEY: 732-3340-1-ND
Q1-Q4 = fets:PMDXB950UPEL: 20 V 500mA, dual P-channel Trench MOSFET; DIGIKEY: 1727-2601-1-ND; MANUFACTURER: NEXPERIA; MPN: PMDXB950UPELZ
Q7-Q11 = fets:CSD22206W: P-Channel NexFet; DIGIKEY: 296-47005-1-ND; MANUFACTURER: TEXAS INSTRUMENTS; MPN: CSD22206WT
R1 = passives:RESISTOR: Resistor Basic schematic elements and footprints for 0603, 1206, and PTH resistors.; DIGIKEY: 311-150JRCT-ND
R2-R7 = passives:RESISTOR: Resistor Basic schematic elements and footprints for 0603, 1206, and PTH resistors.; DIGIKEY: 311-10KJRCT-ND
R8 = passives:RESISTOR: Resistor Basic schematic elements and footprints for 0603, 1206, and PTH resistors.; DIGIKEY: RHM12.0KCDCT-ND
R9 = passives:RESISTOR: Resistor Basic schematic elements and footprints for 0603, 1206, and PTH resistors.; DIGIKEY: 311-80.6KHRCT-ND
R10 = passives:RESISTOR: Resistor Basic schematic elements and footprints for 0603, 1206, and PTH resistors.; DIGIKEY: YAG2956CT-ND
R11 = passives:RESISTOR: Resistor Basic schematic elements and footprints for 0603, 1206, and PTH resistors.; DIGIKEY: 311-1.00MLRCT-ND
R12 = passives:RESISTOR: Resistor Basic schematic elements and footprints for 0603, 1206, and PTH resistors.; DIGIKEY: 311-3.60MLRCT-ND
R13 = passives:RESISTOR: Resistor Basic schematic elements and footprints for 0603, 1206, and PTH resistors.; DIGIKEY: 541-4.22MLCT-ND
R14 = passives:RESISTOR: Resistor Basic schematic elements and footprints for 0603, 1206, and PTH resistors.; DIGIKEY: 541-4.53MLCT-ND
R15 = passives:RESISTOR: Resistor Basic schematic elements and footprints for 0603, 1206, and PTH resistors.; DIGIKEY: YAG3304CT-ND
R16 R17 = passives:RESISTOR: Resistor Basic schematic elements and footprints for 0603, 1206, and PTH resistors.; DIGIKEY: YAG3306CT-ND
R18 = passives:RESISTOR: Resistor Basic schematic elements and footprints for 0603, 1206, and PTH resistors.; DIGIKEY: 541-5.49MHCT-ND
R19 = passives:RESISTOR: Resistor Basic schematic elements and footprints for 0603, 1206, and PTH resistors.; DIGIKEY: 311-5.76MCRCT-ND
R20 = passives:RESISTOR: Resistor Basic schematic elements and footprints for 0603, 1206, and PTH resistors.; DIGIKEY: YAG3310CT-ND
R21 = passives:RESISTOR: Resistor Basic schematic elements and footprints for 0603, 1206, and PTH resistors.; DIGIKEY: P18MGCT-ND
R22 = passives:RESISTOR: Resistor Basic schematic elements and footprints for 0603, 1206, and PTH resistors.; DIGIKEY: HMC0603JT33M0CT-ND
R23-R27 = passives:RESISTOR: Resistor Basic schematic elements and footprints for 0603, 1206, and PTH resistors.; DIGIKEY: 541-100MAHCT-ND
S1 = switches:EVQP2: SWITCH TACTILE SPST-NO 0.02A 15V; DIGIKEY: P11084SCT-ND
TP10 = headers:TEST_POINT_0.040IN: 0.040in Test Point; DIGIKEY: 5001K-ND
U1 = chips:AB1815-T3: Ultra-low current RTC. 55nA quiescent @ 3V. 1.5-3.6V input.; DIGIKEY: 535-11936-1-ND; MANUFACTURER: Abracon; MPN: AB1815-T3
U2 = chips:ADP5091: Ultralow Power Energy Harvester PMU with MPPT and Charge Management with Backup; DIGIKEY: ADP5091ACPZ-1-R7CT-ND; MANUFACTURER: ANALOG DEVICES; MPN: ADP5091ACPZ-1-R7
U3 = chips:EKMB: Passive infrared human detection sensor with built-in amp.; DIGIKEY: 255-3065-ND; MANUFACTURER: PANASONIC; MPN: EKMB1101111
U4 = chips:ISL29125: low power i2c color sensor; DIGIKEY: ISL29125IROZ-T7ACT-ND; MANUFACTURER: INTERSIL; MPN: ISL29125IROZ-T7A
U5 = chips:LIS2DW12: ultra low power 3 axis accelerometer; MANUFACTURER: STMicroelectronics; MOUSER: 511-LIS2DW12TR; MPN: LIS2DW12TR
U6 = chips:MAX17222: Very high efficiency, very low power boost converter suitable for EH applications; DIGIKEY: MAX17222ELT+TCT-ND; MANUFACTURER: MAXIM INTEGRATED; MPN: MAX17222ELT+T
U7 = chips:MAX44009: low power ambient light sensor; DIGIKEY: MAX44009EDT+TCT-ND; MANUFACTURER: MAXIM; MPN: MAX44009EDT+T
U8 = chips:MS5637-02BA03: low power pressure sensor; DIGIKEY: 223-1199-1-ND; MANUFACTURER: TE CONNECTIVITY; MPN: MS563702BA03-50
U9 = chips:NRF51822: Multiprotocol Bluetooth® 4.0 low energy/2.4 GHz RF SoC; DIGIKEY: 1490-1049-1-ND; MANUFACTURER: Nordic Semi; MOUSER: 949-NRF51822-QFAC-R7; MPN: NRF51822-QFAC-R7
U10 = chips:NRF52840: ultra-low power 2.4 GHz wireless system on chip (SoC) integrating a multiprotocol 2.4 GHz transceiver, an ARM® Cortex®-M4F CPU.; DIGIKEY: 1490-1071-1-ND; MANUFACTURER: NORIDIC SEMICONDUCTOR; MPN: NRF52840
U11 = chips:SI7021: IC TEMP SENSOR RH 2% DFN; DIGIKEY: 336-3141-ND; MOUSER: 634-SI7021-A20-GM1
X1 = crystals:7V: TXC CRYSTAL SMD; DIGIKEY: 887-2568-1-ND; MANUFACTURER: TXC CORPORATION; MPN: 7M-32.000MAHV-T
X2 X3 = crystals:ABS05-32.768KHZ: 32.768kHz Crystal; DIGIKEY: 535-11897-1-ND; MANUFACTURER: Abracon; MPN: ABS05-32.768KHZ-9-T
X4 = crystals:ABS07-32.768KHZ: 32.768kHz Crystal; DIGIKEY: 535-9543-1-ND; MANUFACTURER: ABRACON; MPN: ABS07-32.768KHZ-7-T
X5 = crystals:TXC-8Y: 2mmx1.6mm SMD Crystal; DIGIKEY: 887-2003-1-ND